# Altium project PCB_Project1.PrjPCB
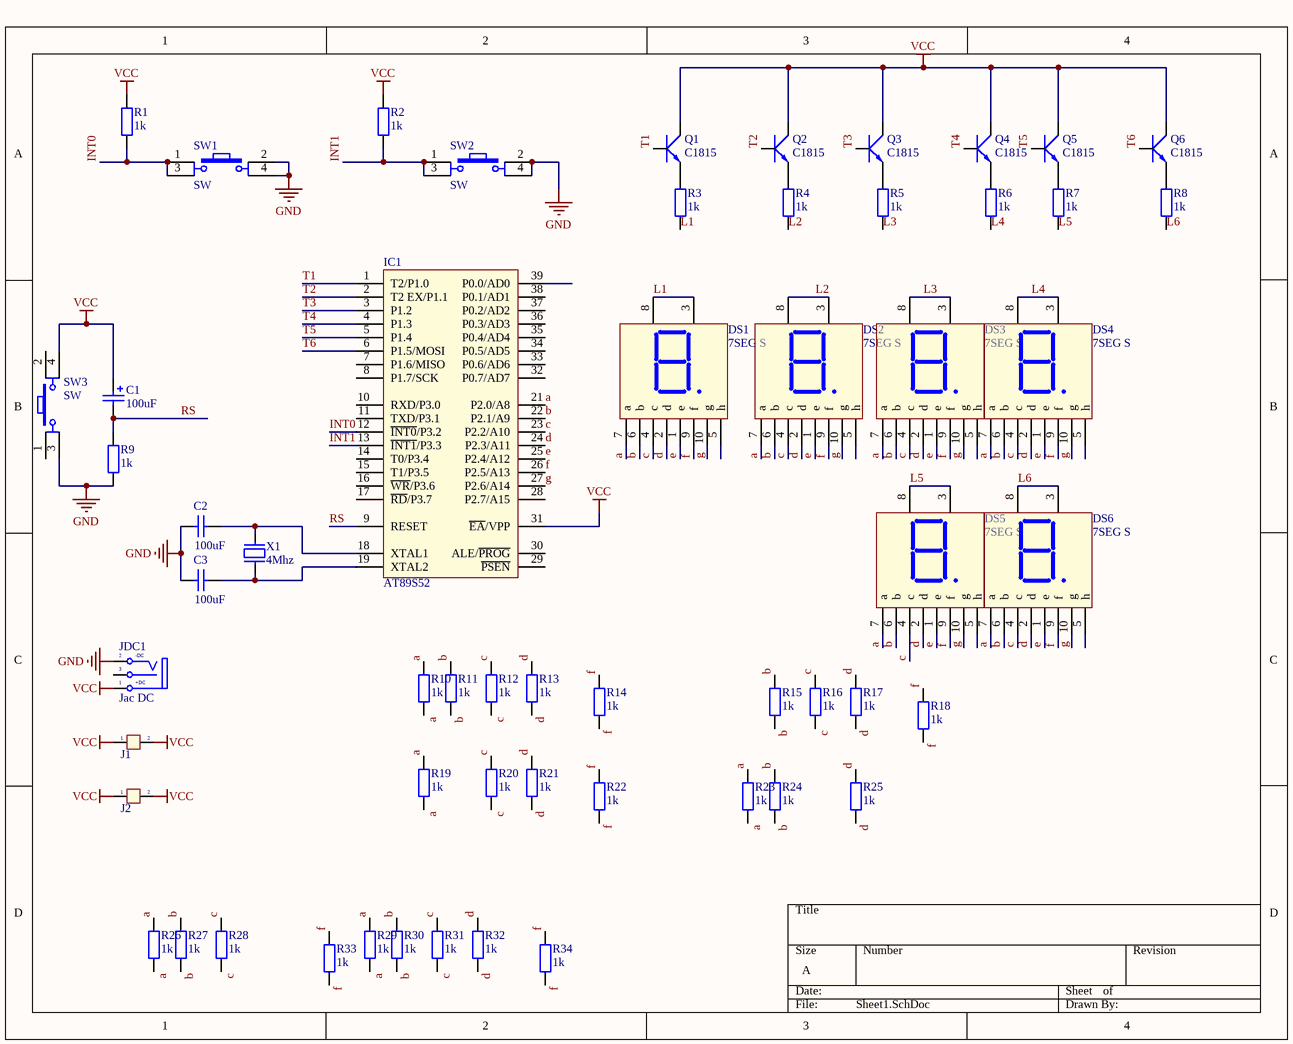
[diagram p0: Sheet1.SchDoc]
1 sheet, 57 parts. Net scope: global (net labels, ports and power ports of the same name join across sheets).
Board file: PCB1.PcbDoc

## Sheet Sheet1.SchDoc
size A

### Parts
C1  value 100uF  [RADIAL C]  (hidden comment: Cap Pol)
C2  value 100uF  [Cap Non-Pol 3mm]  (hidden comment: Cap Non-pol)
C3  value 100uF  [Cap Non-Pol 3mm]  (hidden comment: Cap Non-pol)
DS1  7SEG S  [7SEGS]
DS2  7SEG S  [7SEGS]
DS3  7SEG S  [7SEGS]
DS4  7SEG S  [7SEGS]
DS5  7SEG S  [7SEGS]
DS6  7SEG S  [7SEGS]
IC1  AT89S52  [DIP40/W0.6]
J1  Jumper 2  [JP2]  (value not drawn)
J2  Jumper 2  [JP2]  (value not drawn)
JDC1  Jac DC  [DC-IN]
Q1  C1815  [QTO-92]
Q2  C1815  [QTO-92]
Q3  C1815  [QTO-92]
Q4  C1815  [QTO-92]
Q5  C1815  [QTO-92]
Q6  C1815  [QTO-92]
R1  1k  [R1/4W]
R2  1k  [R1/4W]
R3  1k  [R1/4W]
R4  1k  [R1/4W]
R5  1k  [R1/4W]
R6  1k  [R1/4W]
R7  1k  [R1/4W]
R8  1k  [R1/4W]
R9  1k  [R1/4W]
R10  1k  [R1/4W]
R11  1k  [R1/4W]
R12  1k  [R1/4W]
R13  1k  [R1/4W]
R14  1k  [R1/4W]
R15  1k  [R1/4W]
R16  1k  [R1/4W]
R17  1k  [R1/4W]
R18  1k  [R1/4W]
R19  1k  [R1/4W]
R20  1k  [R1/4W]
R21  1k  [R1/4W]
R22  1k  [R1/4W]
R23  1k  [R1/4W]
R24  1k  [R1/4W]
R25  1k  [R1/4W]
R26  1k  [R1/4W]
R27  1k  [R1/4W]
R28  1k  [R1/4W]
R29  1k  [R1/4W]
R30  1k  [R1/4W]
R31  1k  [R1/4W]
R32  1k  [R1/4W]
R33  1k  [R1/4W]
R34  1k  [R1/4W]
SW1  SW  [SW4]
SW2  SW  [SW4]
SW3  SW  [SW4]
X1  4Mhz  [XT2]

### Nets
GND: C2.1 C3.1 IC1.20(GND) JDC1.2(TN) R9.1 SW1.2 SW1.4 SW2.2 SW2.4 SW3.3
VCC: C1.1 IC1.31(~{EA}/VPP) IC1.40(VCC) J1.1 J1.2 J2.1 J2.2 JDC1.1(T) Q1.2(C) Q2.2(C) Q3.2(C) Q4.2(C) Q5.2(C) Q6.2(C) R1.1 R2.1 SW3.4
a: DS1.7(a) DS2.7(a) DS3.7(a) DS4.7(a) DS5.7(a) DS6.7(a) IC1.21(P2.0/A8) R10.1 R10.2 R19.1 R19.2 R23.1 R23.2 R26.1 R26.2 R29.1 R29.2
b: DS1.6(b) DS2.6(b) DS3.6(b) DS4.6(b) DS5.6(b) DS6.6(b) IC1.22(P2.1/A9) R11.1 R11.2 R15.1 R15.2 R24.1 R24.2 R27.1 R27.2 R30.1 R30.2
c: DS1.4(c) DS2.4(c) DS3.4(c) DS4.4(c) DS5.4(c) DS6.4(c) IC1.23(P2.2/A10) R12.1 R12.2 R16.1 R16.2 R20.1 R20.2 R28.1 R28.2 R31.1 R31.2
d: DS1.2(d) DS2.2(d) DS3.2(d) DS4.2(d) DS5.2(d) DS6.2(d) IC1.24(P2.3/A11) R13.1 R13.2 R17.1 R17.2 R21.1 R21.2 R25.1 R25.2 R32.1 R32.2
e: DS1.1(e) DS2.1(e) DS3.1(e) DS4.1(e) DS5.1(e) DS6.1(e) IC1.25(P2.4/A12)
f: DS1.9(f) DS2.9(f) DS3.9(f) DS4.9(f) DS5.9(f) DS6.9(f) IC1.26(P2.5/A13) R14.1 R14.2 R18.1 R18.2 R22.1 R22.2 R33.1 R33.2 R34.1 R34.2
g: DS1.10(g) DS2.10(g) DS3.10(g) DS4.10(g) DS5.10(g) DS6.10(g) IC1.27(P2.6/A14)
INT0: IC1.12(~{INT0}/P3.2) R1.2 SW1.1 SW1.3
INT1: IC1.13(~{INT1}/P3.3) R2.2 SW2.1 SW2.3
L1: DS1.3(Vcc) DS1.8(Vcc) R3.1
L2: DS2.3(Vcc) DS2.8(Vcc) R4.1
L3: DS3.3(Vcc) DS3.8(Vcc) R5.1
L4: DS4.3(Vcc) DS4.8(Vcc) R6.1
L5: DS5.3(Vcc) DS5.8(Vcc) R7.1
L6: DS6.3(Vcc) DS6.8(Vcc) R8.1
RS: C1.2 IC1.9(RESET) R9.2
T1: IC1.1(T2/P1.0) Q1.3(B)
T2: IC1.2(T2_EX/P1.1) Q2.3(B)
T3: IC1.3(P1.2) Q3.3(B)
T4: IC1.4(P1.3) Q4.3(B)
T5: IC1.5(P1.4) Q5.3(B)
T6: IC1.6(P1.5/MOSI) Q6.3(B)
NetC2_2: C2.2 IC1.18(XTAL1) X1.1
NetC3_2: C3.2 IC1.19(XTAL2) X1.2
NetQ1_1: Q1.1(E) R3.2
NetQ2_1: Q2.1(E) R4.2
NetQ3_1: Q3.1(E) R5.2
NetQ4_1: Q4.1(E) R6.2
NetQ5_1: Q5.1(E) R7.2
NetQ6_1: Q6.1(E) R8.2

Not connected (* = marked no-connect by the designer): DS1 5(h); DS2 5(h); DS3 5(h); DS4 5(h); DS5 5(h); DS6 5(h); IC1 7(P1.6/MISO) 8(P1.7/SCK) 10(RXD/P3.0) 11(TXD/P3.1) 14(T0/P3.4) 15(T1/P3.5) 16(~{WR}/P3.6) 17(~{RD}/P3.7) 28(P2.7/A15) 29(~{PSEN}) 30(ALE/~{PROG}) 32(P0.7/AD7) 33(P0.6/AD6) 34(P0.5/AD5) 35(P0.4/AD4) 36(P0.3/AD3) 37(P0.2/AD2) 38(P0.1/AD1) 39(P0.0/AD0); JDC1 3(S); SW3 1 2

### Notes on the sheet
- (in symbol DCIN) -DC; +DC

### Library data of the parts
C1 = Cap Pol: Polarized Capacitor; LatestRevisionDate: 17-Jul-2002; LatestRevisionNote: Re-released for DXP Platform.; PackageReference: POLAR0.8; Publisher: Altium Limited; Published: 8-Jun-2000
C2 C3 = Cap Non-pol: Non-polarized Capacitor; Published: 8-Jun-2000; LatestRevisionDate: 17-Jul-2002; LatestRevisionNote: Re-released for DXP Platform.; PackageReference: RAD-0.3; Publisher: Altium Limited
DS1-DS6 = LED7S: Single 7 Seg Dipslay; Value: LED 7S SEG
IC1 = AT89S52: AT89S52, 8k Byte Flash Memory , 40 Pin; Value: AT89S52
J1 J2 = JP 2: Value: JP 2
JDC1 = DCIN: Jac DC input; Value: Jac DC
Q1-Q6 = C1815_1: NPN 600mW, ECB; Value: C1815
R1-R34 = R1/4W: Resistor 1/4W; Value: R1/4W - 1K
SW1-SW3 = SW4: Switch button 4 pin; Value: Button chip 4 pin
X1 = XT2: Crystal For all Crystal 2pin.; Value: 4Mhz